# EAGLE design RFM23BPW Breakout Board (EAGLE 9.6.2)
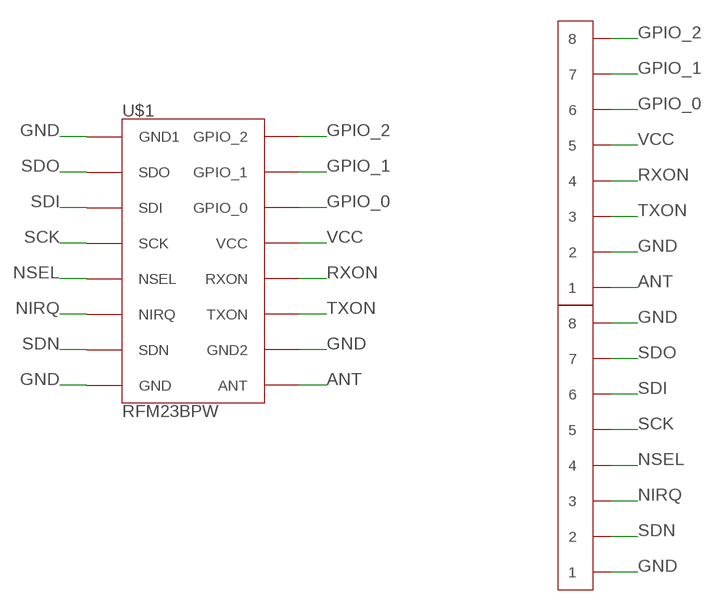
[diagram p0: schematic, sheet 1]

## Parts
U$1  RFM23BPW  [RFM23BPW]
U$2  0.1"_CONNECTOR_8X1  [0.1"_CONNECTOR_8X1]
U$3  0.1"_CONNECTOR_8X1  [0.1"_CONNECTOR_8X1]

## Nets
ANT: U$1.16(ANT) U$3.1
GND: U$1.1(GND) U$1.8(GND1) U$1.15(GND2) U$2.1 U$2.8 U$3.2
GPIO_0: U$1.11(GPIO_0) U$3.6
GPIO_1: U$1.10(GPIO_1) U$3.7
GPIO_2: U$1.9(GPIO_2) U$3.8
NIRQ: U$1.3(NIRQ) U$2.3
NSEL: U$1.4(NSEL) U$2.4
RXON: U$1.13(RXON) U$3.4
SCK: U$1.5(SCK) U$2.5
SDI: U$1.6(SDI) U$2.6
SDN: U$1.2(SDN) U$2.2
SDO: U$1.7(SDO) U$2.7
TXON: U$1.14(TXON) U$3.3
VCC: U$1.12(VCC) U$3.5

## Library data of the parts
U$1 = RFM23BPW:RFM23BPW
U$2 U$3 = 0.1Connector_8x1:0.1"_CONNECTOR_8X1

## Board
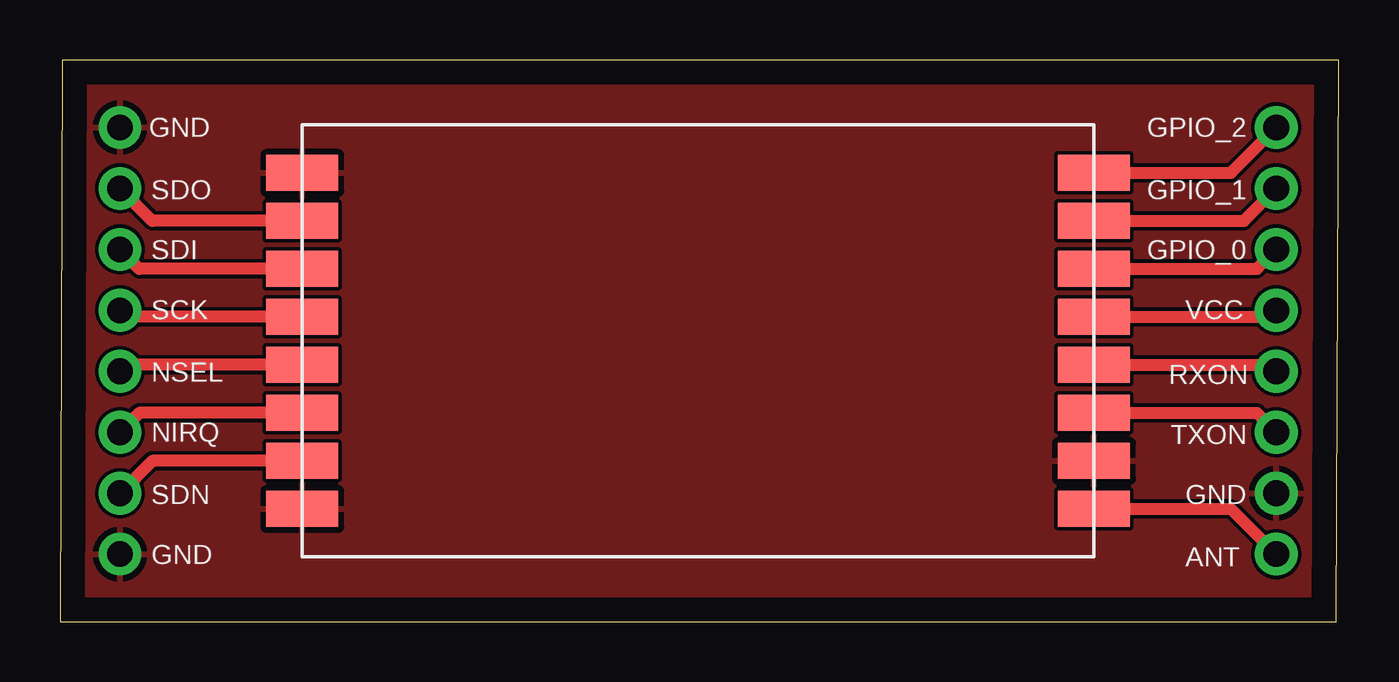
[diagram p1: board, top side]

Size 53.3 x 23.4 mm. Coordinates in mm from the lower left corner, seen from the top.
Outline: 0,0 53.2,0 53.3,23.4 0.1,23.4 0,0
Copper layers (1*16): Top 0.035mm / dielectric 1.5mm / Bottom 0.035mm
Design rules "default": minimum track width 6mil, minimum drill 0.35mm, track to track 6mil, track to pad 6mil, pad to pad 6mil, via to via 6mil, smd to smd 6mil, copper to edge 40mil, drill to drill 6mil, minimum pad ring 10mil, minimum via ring 8mil, stop-mask expansion 4mil, vias tented up to drill 0mil, thermal gap 10mil

### Footprints (pad centres in the part's own frame; a part is rotated, then mirrored left to right if it is on the bottom)
RFM23BPW = smd 3 x 1.5: 1 -16.5,-7; 2 -16.5,-5; 3 -16.5,-3; 4 -16.5,-1; 5 -16.5,1; 6 -16.5,3; 7 -16.5,5; 8 -16.5,7; 9 16.5,7; 10 16.5,5; 11 16.5,3; 12 16.5,1; 13 16.5,-1; 14 16.5,-3; 15 16.5,-5; 16 16.5,-7
0.1"_CONNECTOR_8X1 = drill 1.067 pad 1.778: 1 -8.89,0; 2 -6.35,0; 3 -3.81,0; 4 -1.27,0; 5 1.27,0; 6 3.81,0; 7 6.35,0; 8 8.89,0

### Placement (x,y rotation side)
U$1  26.6,11.7 0 top
U$2  2.5,11.7 90 top
U$3  50.7,11.7 90 top

### Tracks (layer width: path | path; a pad name or v marks a point on that pad's centre or on a via)
ANT
  Top 0.508: U$1.16 48.81,4.7 U$3.1
GND
  pour Top: -0.2,-0.2 53.5,-0.2 53.5,23.6 -0.2,23.6
GPIO_0
  Top 0.508: U$1.11 49.89,14.7 U$3.6
GPIO_1
  Top 0.508: U$1.10 49.35,16.7 U$3.7
GPIO_2
  Top 0.508: U$1.9 48.81,18.7 U$3.8
NIRQ
  Top 0.508: U$1.3 3.31,8.7 U$2.3
NSEL
  Top 0.508: U$1.4 2.77,10.7 U$2.4
RXON
  Top 0.508: U$1.13 50.43,10.7 U$3.4
SCK
  Top 0.508: U$1.5 2.77,12.7 U$2.5
SDI
  Top 0.508: U$1.6 3.31,14.7 U$2.6
SDN
  Top 0.508: U$1.2 3.85,6.7 U$2.2
SDO
  Top 0.508: U$1.7 3.85,16.7 U$2.7
TXON
  Top 0.508: U$1.14 49.89,8.7 U$3.3
VCC
  Top 0.508: U$1.12 50.43,12.7 U$3.5

### Text on the board
tPlace: GND | GPIO_2 | SDO | GPIO_1 | SDI | GPIO_0 | SCK | VCC | NSEL | RXON | NIRQ | TXON | SDN | GND | GND | ANT